# EAGLE design Lab 4 PLCC-20-breakout (EAGLE 9.6.2)
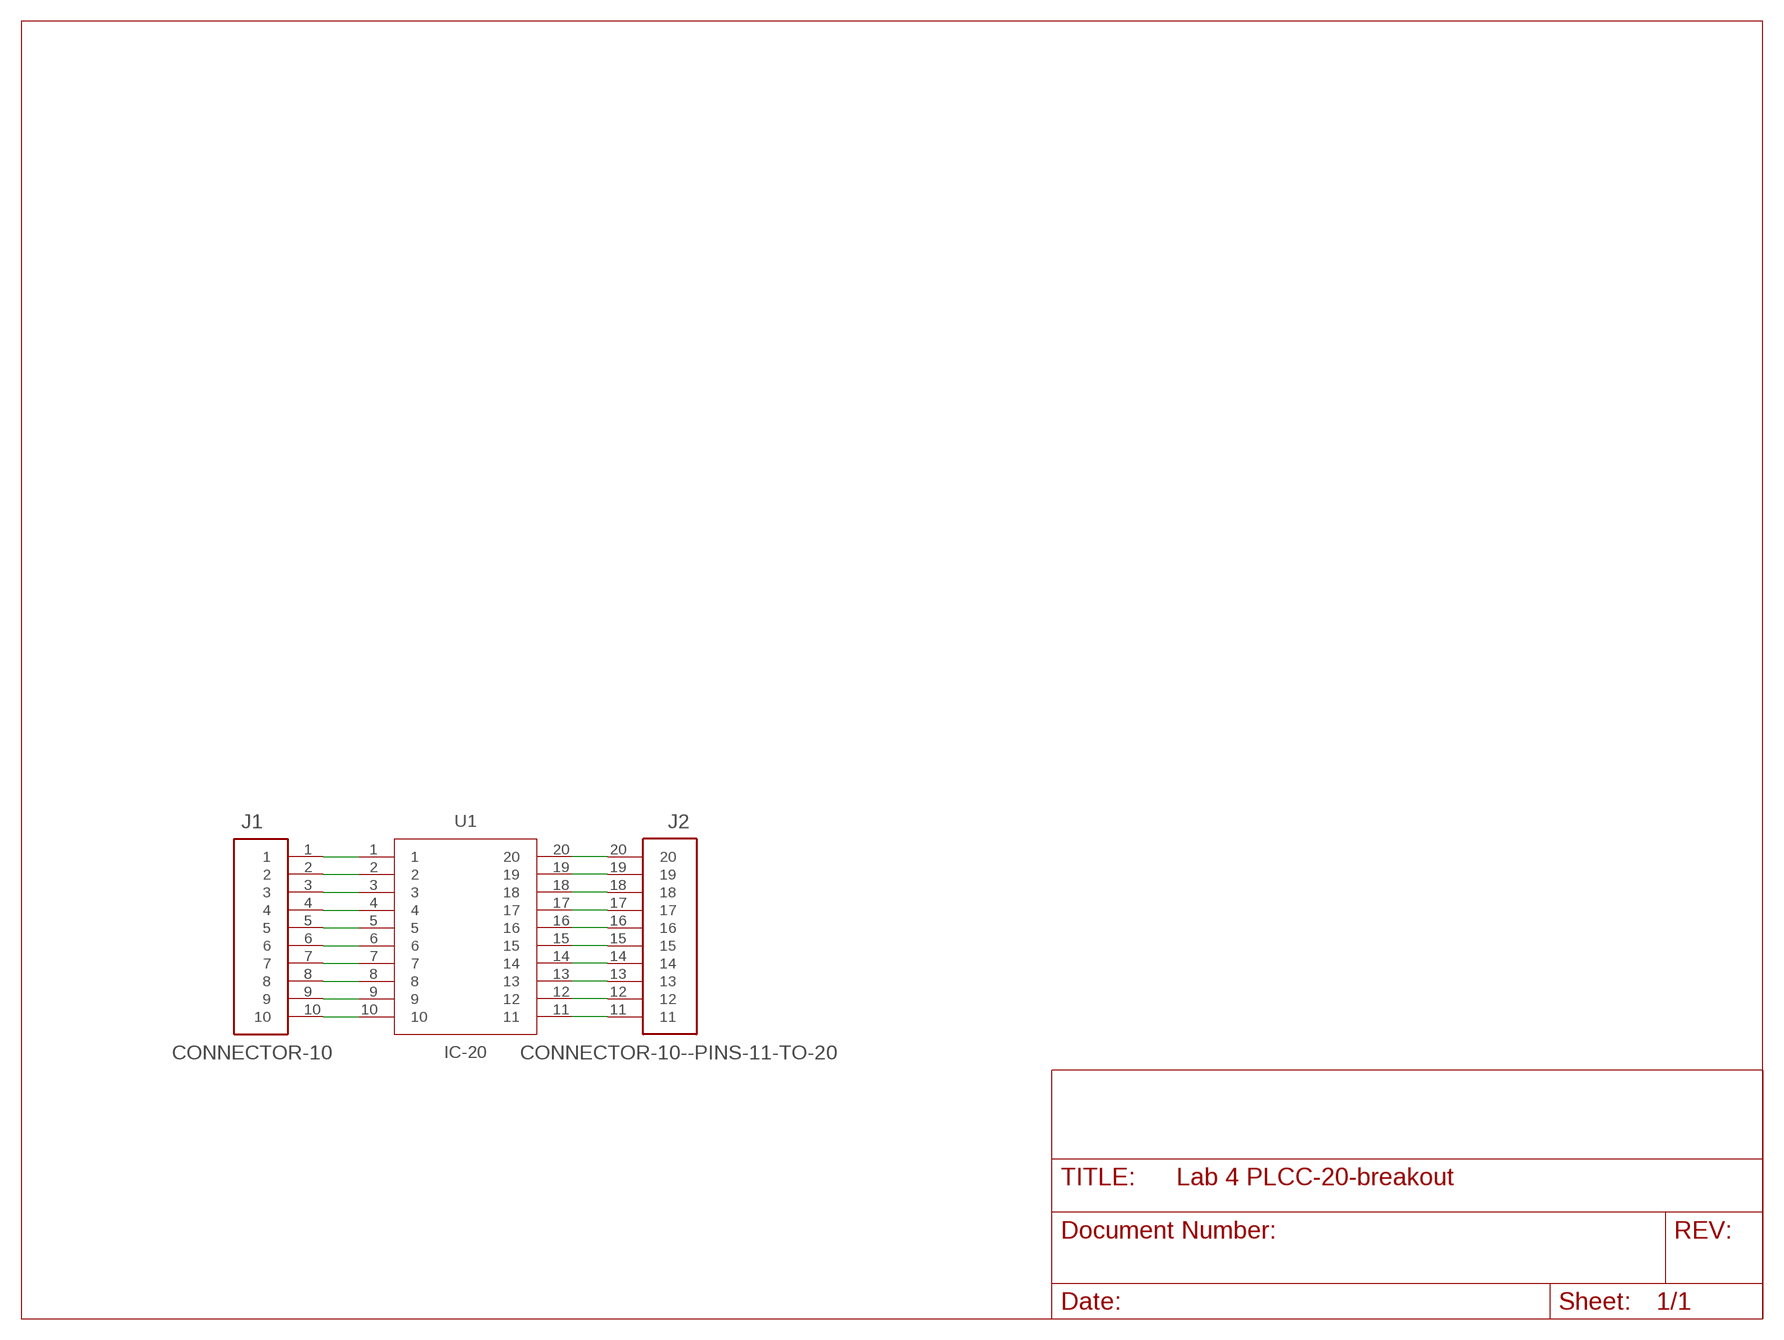
[diagram p0: schematic, sheet 1]

## Parts
J1  CONNECTOR-10  [ESQ-110-XX-XX-S]
J2  CONNECTOR-10--PINS-11-TO-20  [ESQ-110-XX-XX-S--ROUND-PIN-1]
U1  IC-20  [PLCC127P990X990X457-20N]

## Nets
N$1: J1.4 U1.4
N$2: J1.1 U1.1
N$3: J1.5 U1.5
N$4: J1.2 U1.2
N$5: J1.6 U1.6
N$6: J1.3 U1.3
N$7: J1.7 U1.7
N$8: J1.8 U1.8
N$9: J1.9 U1.9
N$10: J1.10 U1.10
N$11: J2.14 U1.14
N$12: J2.11 U1.11
N$13: J2.15 U1.15
N$14: J2.12 U1.12
N$15: J2.16 U1.16
N$16: J2.13 U1.13
N$17: J2.17 U1.17
N$18: J2.18 U1.18
N$19: J2.19 U1.19
N$20: J2.20 U1.20

## Library data of the parts
J1 = eagle-library-engr-245-s22:CONNECTOR-10
J2 = eagle-library-engr-245-s22:CONNECTOR-10--PINS-11-TO-20
U1 = eagle-library-engr-245-s22:IC-20

## Board
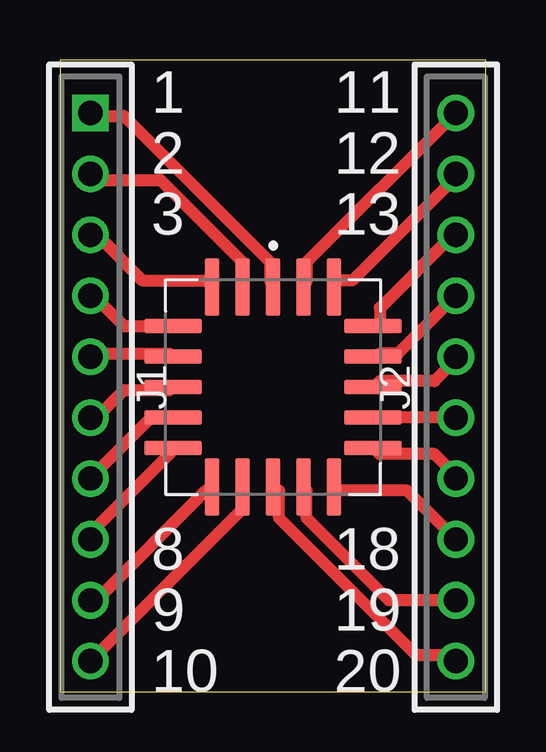
[diagram p1: board, top side]
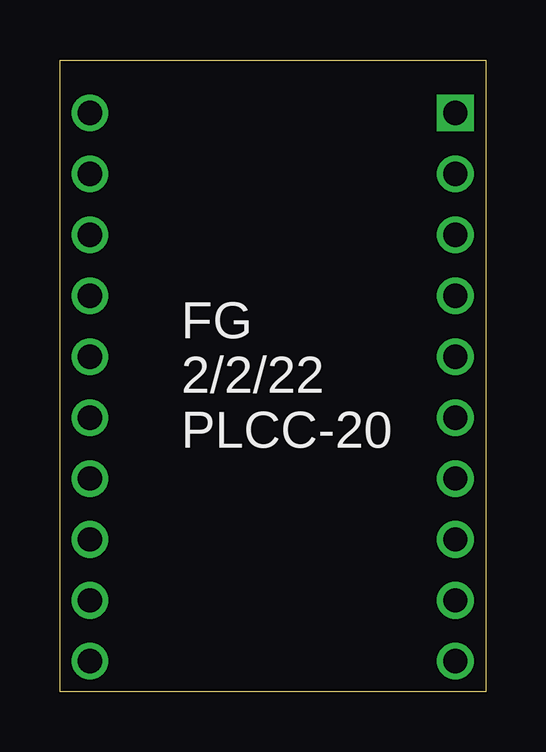
[diagram p2: board, bottom side, seen from below]

Size 17.76 x 26.34 mm. Coordinates in mm from the lower left corner, seen from the top.
Outline: 0,0 17.76,0 17.76,26.34 0,26.34 0,0
Copper layers (1*16): Top 0.035559375mm / dielectric 1.6mm / Bottom 0.035559375mm
Design rules "oshpark-2layer-auto-routing *": minimum track width 20mil, minimum drill 10mil, track to track 10mil, track to pad 8mil, pad to pad 8mil, via to via 8mil, smd to smd 6mil, copper to edge 15mil, drill to drill 6mil, minimum pad ring 6mil, minimum via ring 6mil, stop-mask expansion 2.5mil, vias tented up to drill 0mil, thermal gap 10mil

### Footprints (pad centres in the part's own frame; a part is rotated, then mirrored left to right if it is on the bottom)
ESQ-110-XX-XX-S = drill 1.016 pad 1.524 square: 1 0,0 | drill 1.016 pad 1.524: 2 2.54,0; 3 5.08,0; 4 7.62,0; 5 10.16,0; 6 12.7,0; 7 15.24,0; 8 17.78,0; 9 20.32,0; 10 22.86,0
ESQ-110-XX-XX-S--ROUND-PIN-1 = drill 1.016 pad 1.524: 11 -11.43,0; 12 -8.89,0; 13 -6.35,0; 14 -3.81,0; 15 -1.27,0; 16 1.27,0; 17 3.81,0; 18 6.35,0; 19 8.89,0; 20 11.43,0
PLCC127P990X990X457-20N = smd 0.62 x 2.4: 1 0,4.165; 2 -1.27,4.165; 3 -2.54,4.165; 9 -2.54,-4.165; 10 -1.27,-4.165; 11 0,-4.165; 12 1.27,-4.165; 13 2.54,-4.165; 19 2.54,4.165; 20 1.27,4.165 | smd 2.4 x 0.62: 4 -4.165,2.54; 5 -4.165,1.27; 6 -4.165,0; 7 -4.165,-1.27; 8 -4.165,-2.54; 14 4.165,-2.54; 15 4.165,-1.27; 16 4.165,0; 17 4.165,1.27; 18 4.165,2.54

### Placement (x,y rotation side)
J1  1.27,24.13 270 top
J2  16.51,12.7 90 top
U1  8.89,12.7 0 top

### Tracks (layer width: path | path; a pad name or v marks a point on that pad's centre or on a via)
N$1
  Top 0.508: U1.4 2.67,15.24 1.52,16.38 J1.4
N$2
  Top 0.508: U1.1 8.76,17.14 8.76,17.91 2.67,24 1.52,24 J1.1
N$3
  Top 0.508: U1.5 4.57,14.1 1.52,14.1 J1.5
N$4
  Top 0.508: U1.2 7.62,17.91 4.19,21.34 1.52,21.34 J1.2
N$5
  Top 0.508: U1.6 4.57,12.57 2.67,12.57 1.52,11.43 J1.6
N$6
  Top 0.508: U1.3 6.1,17.14 3.43,17.14 1.52,19.05 J1.3
N$7
  Top 0.508: U1.7 3.81,11.43 J1.7
N$8
  Top 0.508: U1.8 4.57,9.91 1.14,6.48 J1.8
N$9
  Top 0.508: U1.9 6.1,8.38 1.52,3.81 J1.9
N$10
  Top 0.508: U1.10 7.62,7.62 J1.10
N$11
  Top 0.508: U1.14 13.34,9.91 15.62,9.91 16.38,9.14 J2.14
N$12
  Top 0.508: U1.11 9.14,8.38 9.14,7.24 14.86,1.52 16.38,1.52 J2.11
N$13
  Top 0.508: J2.15 U1.15
N$14
  Top 0.508: J2.12 13.72,3.81 10.29,7.24 10.29,8.38 U1.12
N$15
  Top 0.508: U1.16 13.34,12.95 15.62,12.95 16.38,13.72 J2.16
N$16
  Top 0.508: J2.13 14.48,8.38 11.43,8.38 U1.13
N$17
  Top 0.508: J2.17 14.1,14.1 13.34,14.1 U1.17
N$18
  Top 0.508: U1.18 13.34,15.24 13.34,16 16.38,19.05 J2.18
N$19
  Top 0.508: U1.19 11.43,17.14 12.19,17.14 16.38,21.34 J2.19
N$20
  Top 0.508: J2.20 10.29,17.91 10.29,17.14 U1.20

### Text on the board
tPlace: 1 | 11 | 2 | 12 | 3 | 13 | 8 | 18 | 9 | 19 | 10 | 20
bPlace: FG / 2/2/22 / PLCC-20